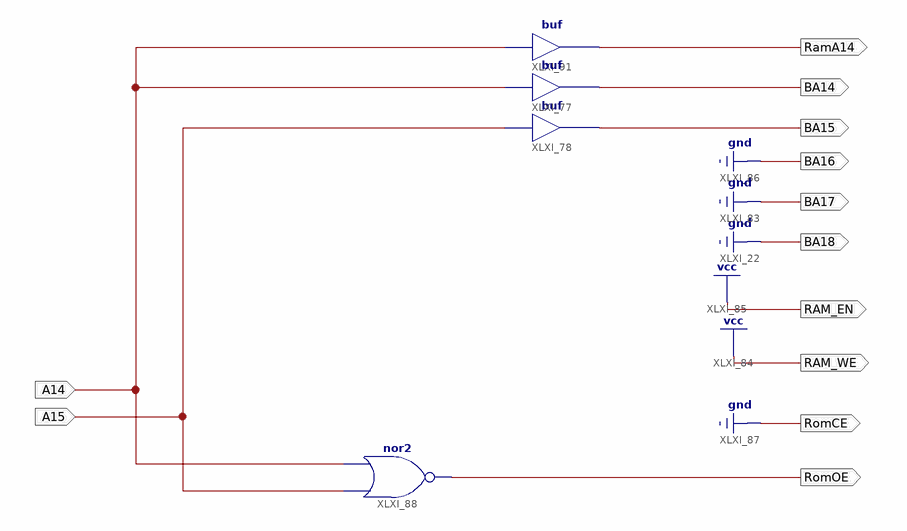
[diagram p0: schematic sheet 1]
// Xilinx ISE schematic A78maxi48k.sch (xc9500xl) as structural Verilog: 4 symbols, 12 ports
module A78maxi48k (
  input  A15,
  input  A14,
  output BA17,
  output BA18,
  output RAM_WE,
  output RAM_EN,
  output BA14,
  output BA15,
  output BA16,
  output RomCE,
  output RomOE,
  output RamA14
);

  buf XLXI_77 (BA14, A14);
  buf XLXI_78 (BA15, A15);
  nor XLXI_88 (RomOE, A15, A14);
  buf XLXI_91 (RamA14, A14);

  assign BA16 = 1'b0;
  assign BA17 = 1'b0;
  assign BA18 = 1'b0;
  assign RAM_EN = 1'b1;
  assign RAM_WE = 1'b1;
  assign RomCE = 1'b0;

  // Notes on the sheet:
  //   LOC on signal BA17 = 41
  //   LOC on signal BA18 = 39
  //   LOC on signal A15 = 36
  //   LOC on signal RAM_WE = 40
  //   LOC on signal RAM_EN = 7
  //   LOC on signal BA14 = 42
  //   LOC on signal BA15 = 33
  //   LOC on signal BA16 = 38
  //   LOC on signal A14 = 37
  //   LOC on signal RomCE = 8
  //   LOC on signal RomOE = 18
  //   LOC on signal RamA14 = 6
endmodule
